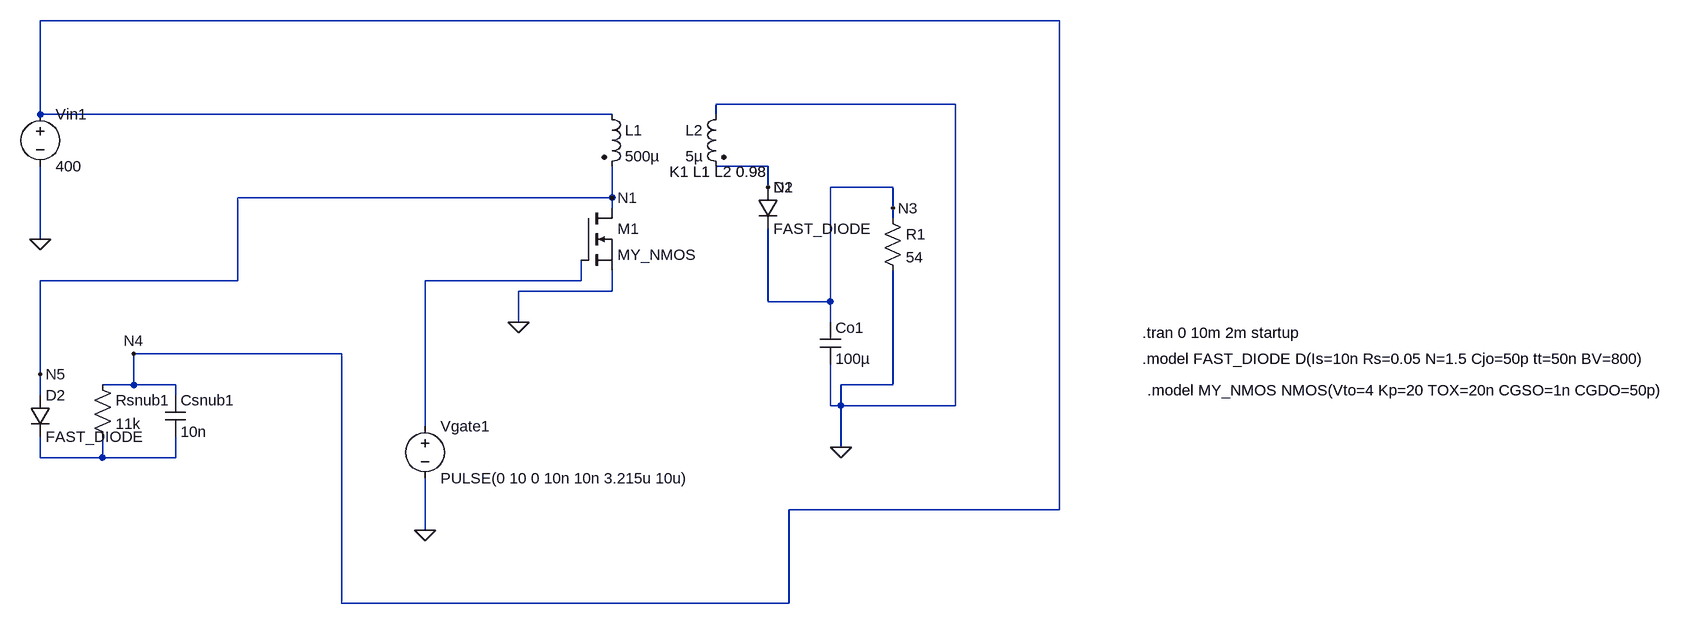
[diagram p0: schematic 11-06-29_tried_improving.asc]
11-06-29_tried_improving.asc, the LTspice schematic file:
Version 4
SHEET 1 1600 704
WIRE 624 -352 -944 -352
WIRE 464 -224 96 -224
WIRE -944 -208 -944 -352
WIRE -64 -208 -944 -208
WIRE 96 -208 96 -224
WIRE 176 -128 96 -128
WIRE 176 -96 176 -128
WIRE 368 -96 272 -96
WIRE -64 -80 -64 -128
WIRE -64 -80 -640 -80
WIRE -64 -64 -64 -80
WIRE 368 -64 368 -96
WIRE 368 -48 368 -64
WIRE -944 -16 -944 -128
WIRE -640 48 -640 -80
WIRE -640 48 -944 48
WIRE -112 48 -112 16
WIRE -112 48 -352 48
WIRE -64 64 -64 32
WIRE -64 64 -208 64
WIRE 176 80 176 -32
WIRE 272 80 272 -96
WIRE 272 80 176 80
WIRE -208 112 -208 64
WIRE 272 112 272 80
WIRE -480 160 -800 160
WIRE -944 192 -944 48
WIRE -800 208 -800 160
WIRE -800 208 -848 208
WIRE -736 208 -800 208
WIRE 368 208 368 32
WIRE 368 208 288 208
WIRE -944 224 -944 192
WIRE -736 224 -736 208
WIRE 272 240 272 176
WIRE 288 240 288 208
WIRE 288 240 272 240
WIRE 464 240 464 -224
WIRE 464 240 288 240
WIRE -352 272 -352 48
WIRE 288 304 288 240
WIRE -944 320 -944 288
WIRE -848 320 -848 288
WIRE -848 320 -944 320
WIRE -736 320 -736 288
WIRE -736 320 -848 320
WIRE 624 400 624 -352
WIRE 624 400 208 400
WIRE -352 432 -352 352
WIRE -480 544 -480 160
WIRE 208 544 208 400
WIRE 208 544 -480 544
FLAG 288 304 0
FLAG -208 112 0
FLAG -352 432 0
FLAG -944 -16 0
FLAG -64 -80 N1
FLAG 176 -96 N2
FLAG 368 -64 N3
FLAG -800 160 N4
FLAG -944 192 N5
DATAFLAG -176 64 ""
SYMBOL voltage -944 -224 R0
WINDOW 123 0 0 Left 0
WINDOW 39 0 0 Left 0
SYMATTR InstName Vin1
SYMATTR Value 400
SYMBOL ind2 -80 -224 R0
SYMATTR InstName L1
SYMATTR Value 500µ
SYMATTR Type ind
SYMBOL ind2 112 -224 M0
SYMATTR InstName L2
SYMATTR Value 5µ
SYMATTR Type ind
SYMBOL cap 256 112 R0
SYMATTR InstName Co1
SYMATTR Value 100µ
SYMBOL res 352 -64 R0
SYMATTR InstName R1
SYMATTR Value 54
SYMBOL nmos -112 -64 R0
SYMATTR InstName M1
SYMATTR Value MY_NMOS
SYMBOL diode 160 -96 R0
SYMATTR InstName D1
SYMATTR Value FAST_DIODE
SYMBOL voltage -352 256 R0
WINDOW 123 0 0 Left 0
WINDOW 39 0 0 Left 0
SYMATTR InstName Vgate1
SYMATTR Value PULSE(0 10 0 10n 10n 3.215u 10u)
SYMBOL diode -960 224 R0
SYMATTR InstName D2
SYMATTR Value FAST_DIODE
SYMBOL res -864 192 R0
SYMATTR InstName Rsnub1
SYMATTR Value 11k
SYMBOL cap -752 224 R0
SYMATTR InstName Csnub1
SYMATTR Value 10n
TEXT 24 -120 Left 2 !K1 L1 L2 0.98
TEXT 752 128 Left 2 !.tran 0 10m 2m startup
TEXT 760 216 Left 2 !.model MY_NMOS NMOS(Vto=4 Kp=20 TOX=20n CGSO=1n CGDO=50p)
TEXT 752 168 Left 2 !.model FAST_DIODE D(Is=10n Rs=0.05 N=1.5 Cjo=50p tt=50n BV=800)

The netlist it stands for:
* 11-06-29_tried_improving.asc
Vin1 N4 0 400
L1 N4 N5 500µ
L2 0 N2 5µ
Co1 N3 0 100µ
R1 N3 0 54
M1 N5 N001 0 0 MY_NMOS
D1 N2 N3 FAST_DIODE
Vgate1 N001 0 PULSE(0 10 0 10n 10n 3.215u 10u)
D2 N5 N002 FAST_DIODE
Rsnub1 N4 N002 11k
Csnub1 N4 N002 10n
.model D D
.lib standard.dio
.model NMOS NMOS
.model PMOS PMOS
.lib standard.mos
K1 L1 L2 0.98
.tran 0 10m 2m startup
.model MY_NMOS NMOS(Vto=4 Kp=20 TOX=20n CGSO=1n CGDO=50p)
.model FAST_DIODE D(Is=10n Rs=0.05 N=1.5 Cjo=50p tt=50n BV=800)
.backanno
.end